# EAGLE design romtool (EAGLE 5.11)
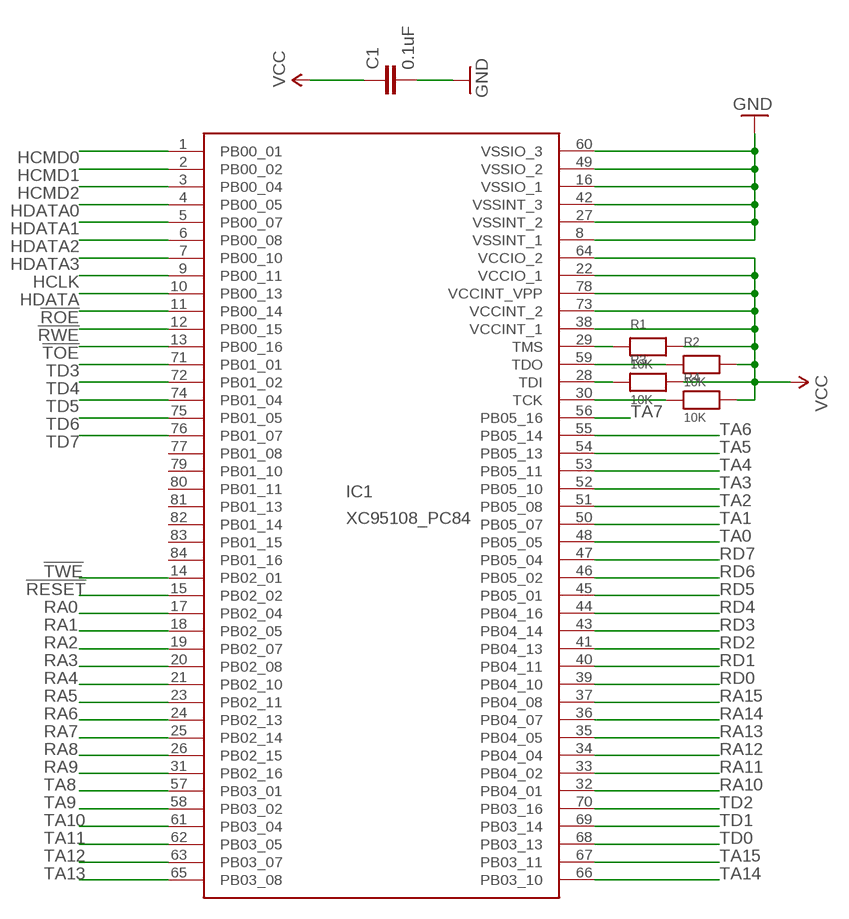
[diagram p0: schematic, sheet 1]

## Parts
C1  0.1uF  CAP0805  [0805]
IC1  XC95108_PC84  [PC84]
R1  10K  RESISTOR0805  [0805]
R2  10K  RESISTOR0805  [0805]
R3  10K  RESISTOR0805  [0805]
R4  10K  RESISTOR0805  [0805]

## Nets
!RESET: IC1.15(PB02_02)
!ROE: IC1.11(PB00_14)
!RWE: IC1.12(PB00_15)
!TOE: IC1.13(PB00_16)
!TWE: IC1.14(PB02_01)
GND: C1.2 IC1.8(VSSINT_1) IC1.16(VSSIO_1) IC1.27(VSSINT_2) IC1.42(VSSINT_3) IC1.49(VSSIO_2) IC1.60(VSSIO_3)
HCLK: IC1.9(PB00_11)
HCMD0: IC1.1(PB00_01)
HCMD1: IC1.2(PB00_02)
HCMD2: IC1.3(PB00_04)
HDATA: IC1.10(PB00_13)
HDATA0: IC1.4(PB00_05)
HDATA1: IC1.5(PB00_07)
HDATA2: IC1.6(PB00_08)
HDATA3: IC1.7(PB00_10)
RA0: IC1.17(PB02_04)
RA1: IC1.18(PB02_05)
RA2: IC1.19(PB02_07)
RA3: IC1.20(PB02_08)
RA4: IC1.21(PB02_10)
RA5: IC1.23(PB02_11)
RA6: IC1.24(PB02_13)
RA7: IC1.25(PB02_14)
RA8: IC1.26(PB02_15)
RA9: IC1.31(PB02_16)
RA10: IC1.32(PB04_01)
RA11: IC1.33(PB04_02)
RA12: IC1.34(PB04_04)
RA13: IC1.35(PB04_05)
RA14: IC1.36(PB04_07)
RA15: IC1.37(PB04_08)
RD0: IC1.39(PB04_10)
RD1: IC1.40(PB04_11)
RD2: IC1.41(PB04_13)
RD3: IC1.43(PB04_14)
RD4: IC1.44(PB04_16)
RD5: IC1.45(PB05_01)
RD6: IC1.46(PB05_02)
RD7: IC1.47(PB05_04)
TA0: IC1.48(PB05_05)
TA1: IC1.50(PB05_07)
TA2: IC1.51(PB05_08)
TA3: IC1.52(PB05_10)
TA4: IC1.53(PB05_11)
TA5: IC1.54(PB05_13)
TA6: IC1.55(PB05_14)
TA7: IC1.56(PB05_16)
TA8: IC1.57(PB03_01)
TA9: IC1.58(PB03_02)
TA10: IC1.61(PB03_04)
TA11: IC1.62(PB03_05)
TA12: IC1.63(PB03_07)
TA13: IC1.65(PB03_08)
TA14: IC1.66(PB03_10)
TA15: IC1.67(PB03_11)
TCK: IC1.30(TCK) R4.1
TD0: IC1.68(PB03_13)
TD1: IC1.69(PB03_14)
TD2: IC1.70(PB03_16)
TD3: IC1.71(PB01_01)
TD4: IC1.72(PB01_02)
TD5: IC1.74(PB01_04)
TD6: IC1.75(PB01_05)
TD7: IC1.76(PB01_07)
TDI: IC1.28(TDI) R3.1
TDO: IC1.59(TDO) R2.1
TMS: IC1.29(TMS) R1.1
VCC: C1.1 IC1.22(VCCIO_1) IC1.38(VCCINT_1) IC1.64(VCCIO_2) IC1.73(VCCINT_2) IC1.78(VCCINT_VPP) R1.2 R2.2 R3.2 R4.2
Unconnected: IC1.77(PB01_08) IC1.79(PB01_10) IC1.80(PB01_11) IC1.81(PB01_13) IC1.82(PB01_14) IC1.83(PB01_15) IC1.84(PB01_16)

## Library data of the parts
C1 = SparkFun:CAP: Capacitor Standard 0603 ceramic capacitor, and 0.1" leaded capacitor.
IC1 = xilinx:XC95108_PC84: xc95108_pc84 edit this description Auto generated by make-symbol-device-package-bsdl.ulp Rev. 34 Source: xc95108_pc84.bsd
R1-R4 = microbuilder:RESISTOR: Resistors 0402 - 0402 Surface Mount Package 10.0K 1% 1/16W [Digikey: 311-10.0KLRTR-ND] 0603 - 0603 Surface Mount Package 0 Ohm 1/10 Watt 1% Resistor 15 Ohm 1/10 Watt 1% Resistor 33 Ohm 1/10 Watt 1% Resistor 49.9 Ohm 1/10 Watt 1% Resistor 100 Ohm 1/10 Watt 1% Resistor 150 Ohm 1/10 Watt 1% Resistor 240 Ohm 1/10 Watt 1% Resistor 390 Ohm 1/10 Watt 1% Resistor 560 Ohm 1/10 Watt 1% Resistor 750 Ohm 1/10 Watt 1% Resistor 1.0K Ohm 1/10 Watt 1% Resistor 1.5K Ohm 1/10 Watt 1% Resistor 2.0K Ohm 1/10 Watt 1% Resistor 4.7K Ohm 1/10 Watt 1% Resistor 10.0K Ohm 1/10 Watt 1% Resistor 20.0K Ohm 1/10 Watt 1% Resistor 33.0K Ohm 1/10 Watt 1% Resistor 100.0K Ohm 1/10 Watt 1% Resistor 0805 - 0805 Surface Mount Package 0 Ohm 1/8 Watt 1% Resistor 33 Ohm 1/8 Watt 1% Resistor 100 Ohm 1/8 Watt 1% Resistor 150 Ohm 1/8 Watt 1% Resistor 200 Ohm 1/8 Watt 1% Resistor 240 Ohm 1/8 Watt 1% Resistor 330 Ohm 1/8 Watt 1% Resistor 390 Ohm 1/8 Watt 1% Resistor 470 Ohm 1/8 Watt 1% Resistor 1.0K Ohm 1/8 Watt 1% Resistor 1.5K Ohm 1/8 Watt 1% Resistor 2.0K Ohm 1/8 Watt 1% Resistor 4.7K Ohm 1/8 Watt 1% Resistor 5.1K Ohm 1/8 Watt 1% Resistor 5.6K Ohm 1/8 Watt 1% Resistor 10.0K Ohm 1/8 Watt 1% Resistor 22.0K Ohm 1/8 Watt 1% Resistor 33.0K Ohm 1/8 Watt 1% Resistor 100K Ohm 1/8 Watt 1% Resistor 1206 - 1206 Surface Mount Package

## Board
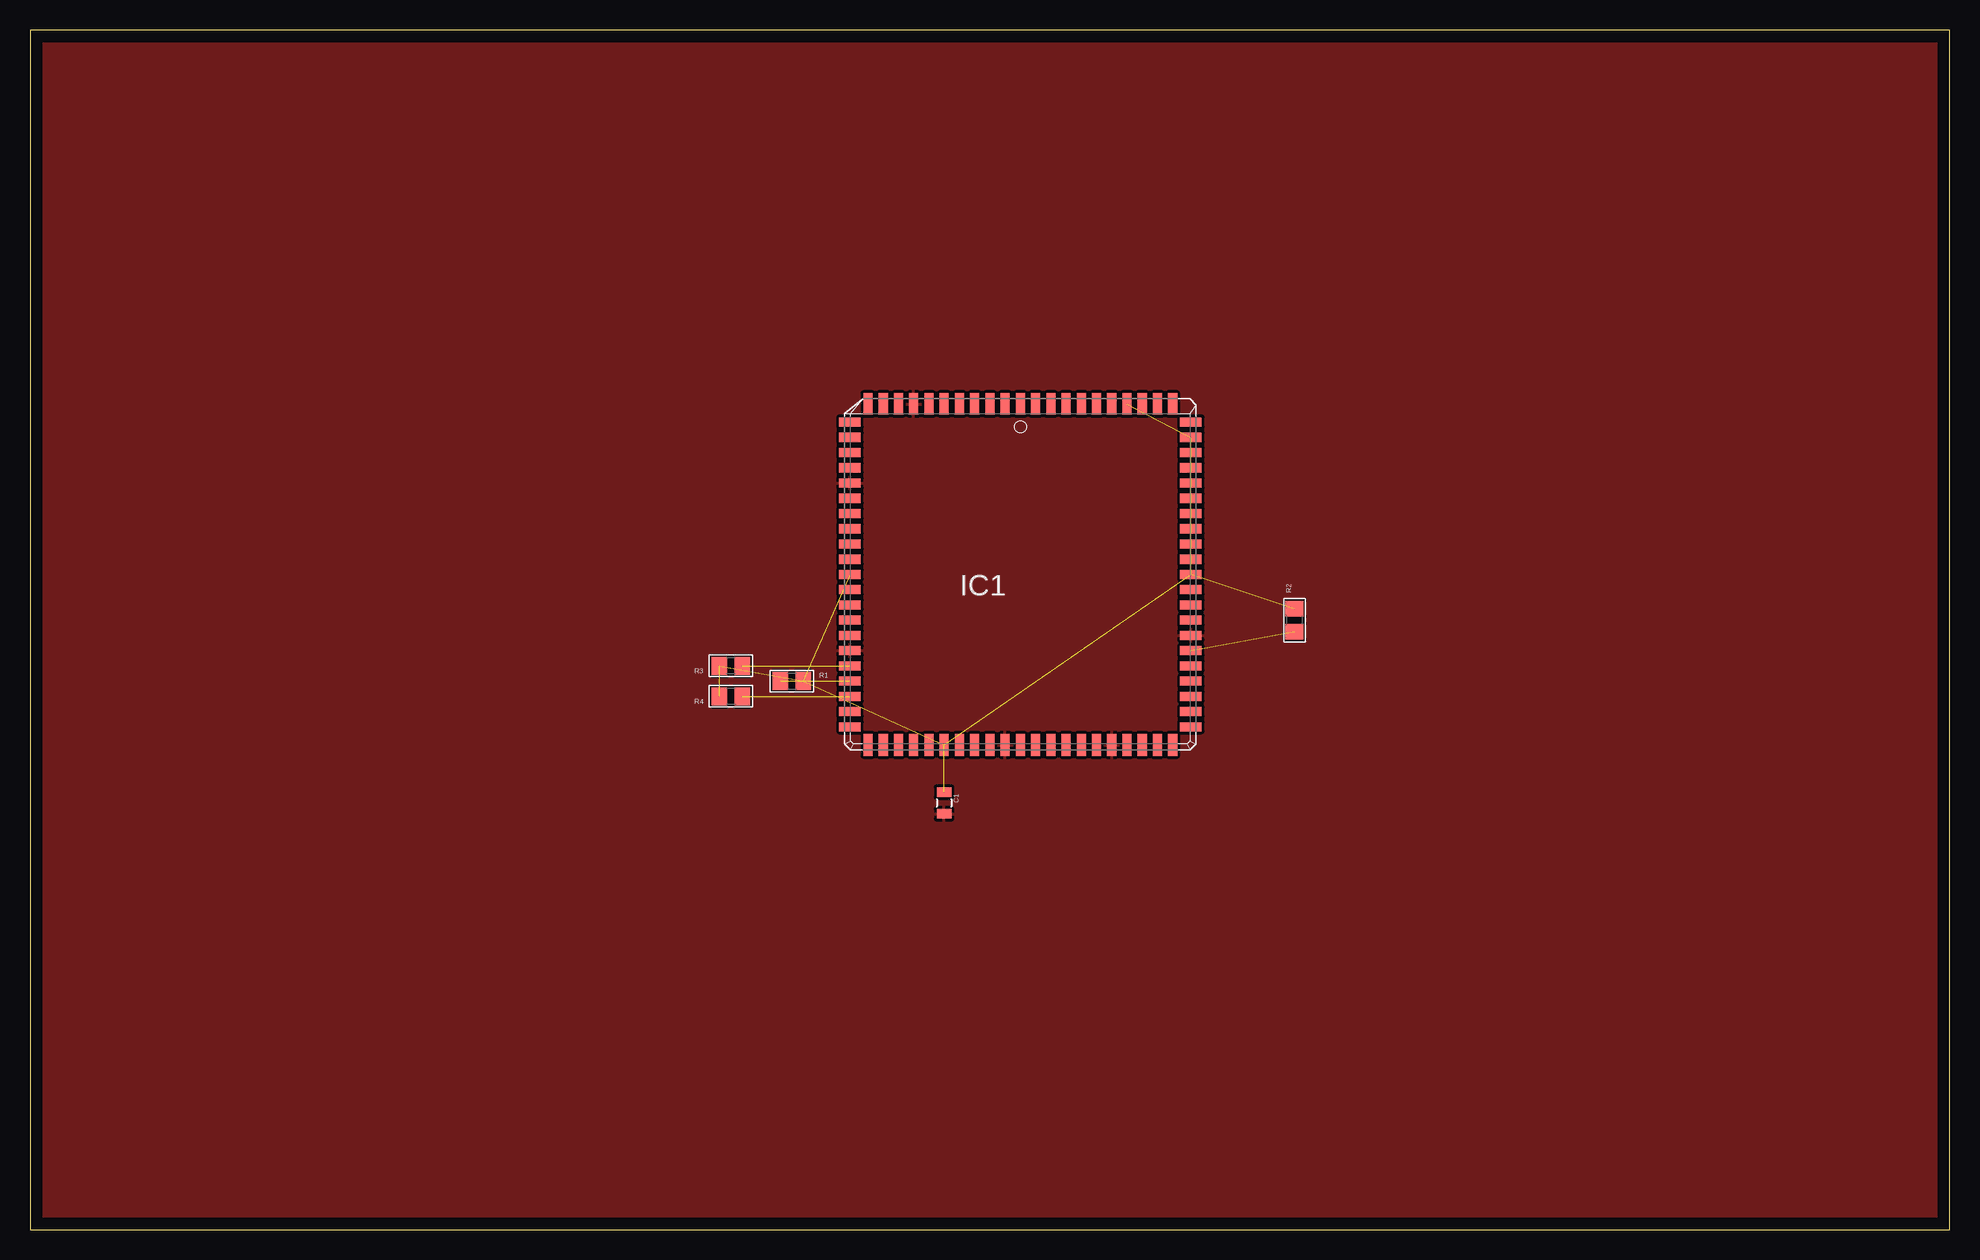
[diagram p1: board, top side]

Size 160 x 100 mm. Coordinates in mm from the lower left corner, seen from the top.
Outline: 0,0 160,0 160,100 0,100 0,0
Copper layers (1*16): Top 0.035mm / dielectric 1.5mm / Bottom 0.035mm
Design rules "default": minimum track width 10mil, minimum drill 24mil, track to track 8mil, track to pad 8mil, pad to pad 8mil, via to via 8mil, smd to smd 8mil, copper to edge 40mil, drill to drill 8mil, minimum pad ring 10mil, minimum via ring 8mil, stop-mask expansion 4mil, vias tented up to drill 0mil, thermal gap 10mil

### Footprints (pad centres in the part's own frame; a part is rotated, then mirrored left to right if it is on the bottom)
0805 = smd 0.8 x 1.2: 1 -0.9,0; 2 0.9,0
PC84 = smd 0.76 x 1.8: 1 0,12.94; 2 -1.27,12.94; 3 -2.54,12.94; 4 -3.81,12.94; 5 -5.08,12.94; 6 -6.35,12.94; 7 -7.62,12.94; 8 -8.89,12.94; 9 -10.16,12.94; 10 -11.43,12.94; 11 -12.7,12.94; 33 -12.7,-15.48; 34 -11.43,-15.48; 35 -10.16,-15.48; 36 -8.89,-15.48; 37 -7.62,-15.48; 38 -6.35,-15.48; 39 -5.08,-15.48; 40 -3.81,-15.48; 41 -2.54,-15.48; 42 -1.27,-15.48; 43 0,-15.48; 44 1.27,-15.48; 45 2.54,-15.48; 46 3.81,-15.48; 47 5.08,-15.48; 48 6.35,-15.48; 49 7.62,-15.48; 50 8.89,-15.48; 51 10.16,-15.48; 52 11.43,-15.48; 53 12.7,-15.48; 75 12.7,12.94; 76 11.43,12.94; 77 10.16,12.94; 78 8.89,12.94; 79 7.62,12.94; 80 6.35,12.94; 81 5.08,12.94; 82 3.81,12.94; 83 2.54,12.94; 84 1.27,12.94 | smd 1.8 x 0.76: 12 -14.21,11.43; 13 -14.21,10.16; 14 -14.21,8.89; 15 -14.21,7.62; 16 -14.21,6.35; 17 -14.21,5.08; 18 -14.21,3.81; 19 -14.21,2.54; 20 -14.21,1.27; 21 -14.21,0; 22 -14.21,-1.27; 23 -14.21,-2.54; 24 -14.21,-3.81; 25 -14.21,-5.08; 26 -14.21,-6.35; 27 -14.21,-7.62; 28 -14.21,-8.89; 29 -14.21,-10.16; 30 -14.21,-11.43; 31 -14.21,-12.7; 32 -14.21,-13.97; 54 14.21,-13.97; 55 14.21,-12.7; 56 14.21,-11.43; 57 14.21,-10.16; 58 14.21,-8.89; 59 14.21,-7.62; 60 14.21,-6.35; 61 14.21,-5.08; 62 14.21,-3.81; 63 14.21,-2.54; 64 14.21,-1.27; 65 14.21,0; 66 14.21,1.27; 67 14.21,2.54; 68 14.21,3.81; 69 14.21,5.08; 70 14.21,6.35; 71 14.21,7.62; 72 14.21,8.89; 73 14.21,10.16; 74 14.21,11.43
0805' = smd 1.3 x 1.5: 1 -0.95,0; 2 0.95,0

### Placement (x,y rotation side)
C1  76.2,35.56 270 top
IC1  82.55,55.88 0 top
R1  10K  [0805']  63.5,45.72 0 top
R2  10K  [0805']  105.41,50.8 90 top
R3  10K  [0805']  58.42,46.99 180 top
R4  10K  [0805']  58.42,44.45 180 top

### Tracks (layer width: path | path; a pad name or v marks a point on that pad's centre or on a via)
GND
  pour Top (isolate 0.254): 158.75,100.33 0,100.33 0,0 160.02,0 160.02,100.33
TCK  (1 unrouted)
TDI  (1 unrouted)
TDO  (1 unrouted)
TMS  (1 unrouted)
VCC  (9 unrouted)